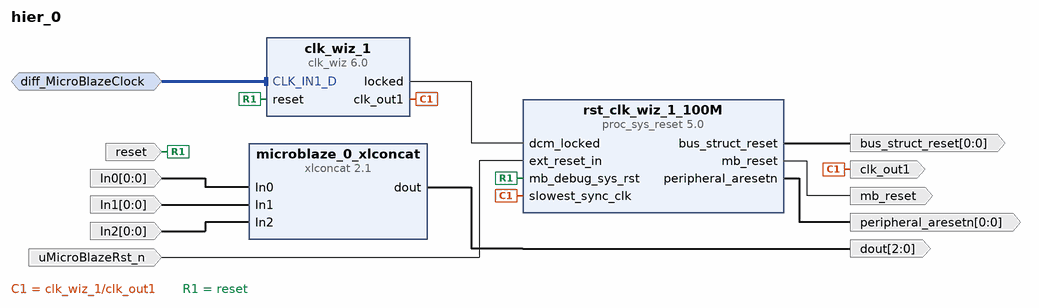
[diagram p0: block diagram of the top level]
# Vivado block design hier_0, xcau25p-ffvb676-2-e, Vivado 2024.1
create_bd_design hier_0

create_bd_intf_port -mode Slave -vlnv xilinx.com:interface:diff_clock_rtl:1.0 diff_MicroBlazeClock
create_bd_port -dir I -from 0 -to 0 In0
create_bd_port -dir I -from 0 -to 0 In1
create_bd_port -dir I -from 0 -to 0 In2
create_bd_port -dir O -from 0 -to 0 -type rst bus_struct_reset
set_property -dict {CONFIG.POLARITY ACTIVE_HIGH} [get_bd_ports bus_struct_reset]
create_bd_port -dir O -type clk clk_out1
create_bd_port -dir O -from 2 -to 0 dout
create_bd_port -dir O -type rst mb_reset
set_property -dict {CONFIG.POLARITY ACTIVE_HIGH} [get_bd_ports mb_reset]
create_bd_port -dir O -from 0 -to 0 -type rst peripheral_aresetn
create_bd_port -dir I -type rst reset
set_property -dict {CONFIG.POLARITY ACTIVE_HIGH} [get_bd_ports reset]
create_bd_port -dir I -type rst uMicroBlazeRst_n

create_bd_cell -type ip -vlnv xilinx.com:ip:clk_wiz:6.0 clk_wiz_1
set_property -dict {CONFIG.PRIM_SOURCE Differential_clock_capable_pin} [get_bd_cells clk_wiz_1]
create_bd_cell -type ip -vlnv xilinx.com:ip:xlconcat:2.1 microblaze_0_xlconcat
set_property -dict {CONFIG.NUM_PORTS 3} [get_bd_cells microblaze_0_xlconcat]
create_bd_cell -type ip -vlnv xilinx.com:ip:proc_sys_reset:5.0 rst_clk_wiz_1_100M

# ---- connections ----

connect_bd_intf_net [get_bd_intf_pins clk_wiz_1/CLK_IN1_D] [get_bd_intf_ports diff_MicroBlazeClock]
connect_bd_net -net In0_1 [get_bd_ports In0] [get_bd_pins microblaze_0_xlconcat/In0]
connect_bd_net -net In1_1 [get_bd_ports In1] [get_bd_pins microblaze_0_xlconcat/In1]
connect_bd_net -net In2_1 [get_bd_ports In2] [get_bd_pins microblaze_0_xlconcat/In2]
connect_bd_net [get_bd_pins clk_wiz_1/clk_out1] [get_bd_ports clk_out1] [get_bd_pins rst_clk_wiz_1_100M/slowest_sync_clk]
connect_bd_net [get_bd_pins clk_wiz_1/locked] [get_bd_pins rst_clk_wiz_1_100M/dcm_locked]
connect_bd_net [get_bd_pins microblaze_0_xlconcat/dout] [get_bd_ports dout]
connect_bd_net [get_bd_ports reset] [get_bd_pins clk_wiz_1/reset] [get_bd_pins rst_clk_wiz_1_100M/mb_debug_sys_rst]
connect_bd_net [get_bd_pins rst_clk_wiz_1_100M/bus_struct_reset] [get_bd_ports bus_struct_reset]
connect_bd_net [get_bd_pins rst_clk_wiz_1_100M/mb_reset] [get_bd_ports mb_reset]
connect_bd_net [get_bd_pins rst_clk_wiz_1_100M/peripheral_aresetn] [get_bd_ports peripheral_aresetn]
connect_bd_net [get_bd_ports uMicroBlazeRst_n] [get_bd_pins rst_clk_wiz_1_100M/ext_reset_in]

validate_bd_design
save_bd_design
